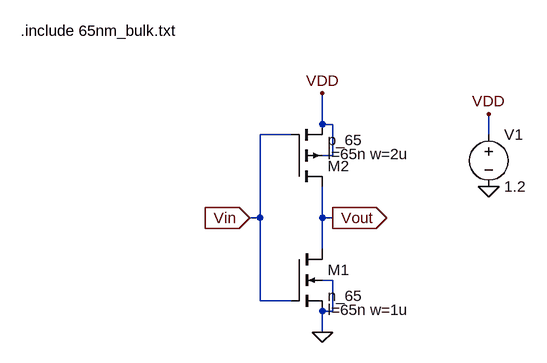
[diagram p0: schematic inverter.asc]
inverter.asc, the LTspice schematic file:
Version 4
SHEET 1 880 680
WIRE 400 224 400 176
WIRE 416 224 400 224
WIRE 352 240 304 240
WIRE 656 240 656 208
WIRE 416 272 416 224
WIRE 416 272 400 272
WIRE 304 368 304 240
WIRE 304 368 288 368
WIRE 400 368 400 320
WIRE 416 368 400 368
WIRE 400 416 400 368
WIRE 416 464 400 464
WIRE 304 496 304 368
WIRE 352 496 304 496
WIRE 416 512 416 464
WIRE 416 512 400 512
WIRE 400 544 400 512
FLAG 400 544 0
FLAG 400 176 VDD
FLAG 656 208 VDD
FLAG 656 320 0
FLAG 288 368 Vin
IOPIN 288 368 In
FLAG 416 368 Vout
IOPIN 416 368 Out
SYMBOL nmos4 352 416 R0
WINDOW 123 56 94 Left 2
SYMATTR InstName M1
SYMATTR Value n_65
SYMATTR Value2 l=65n w=1u
SYMBOL pmos4 352 320 M180
WINDOW 123 56 50 Left 2
SYMATTR InstName M2
SYMATTR Value p_65
SYMATTR Value2 l=65n w=2u
SYMBOL Voltage 656 224 R0
SYMATTR InstName V1
SYMATTR Value 1.2
TEXT -64 80 Left 2 !.include 65nm_bulk.txt

The netlist it stands for:
* inverter.asc
M1 Vout Vin 0 0 n_65 l=65n w=1u
M2 Vout Vin VDD VDD p_65 l=65n w=2u
V1 VDD 0 1.2
.model NMOS NMOS
.model PMOS PMOS
.lib standard.mos
.include 65nm_bulk.txt
.backanno
.end